# EAGLE design TCsolo_v1 (EAGLE 9.6.2)
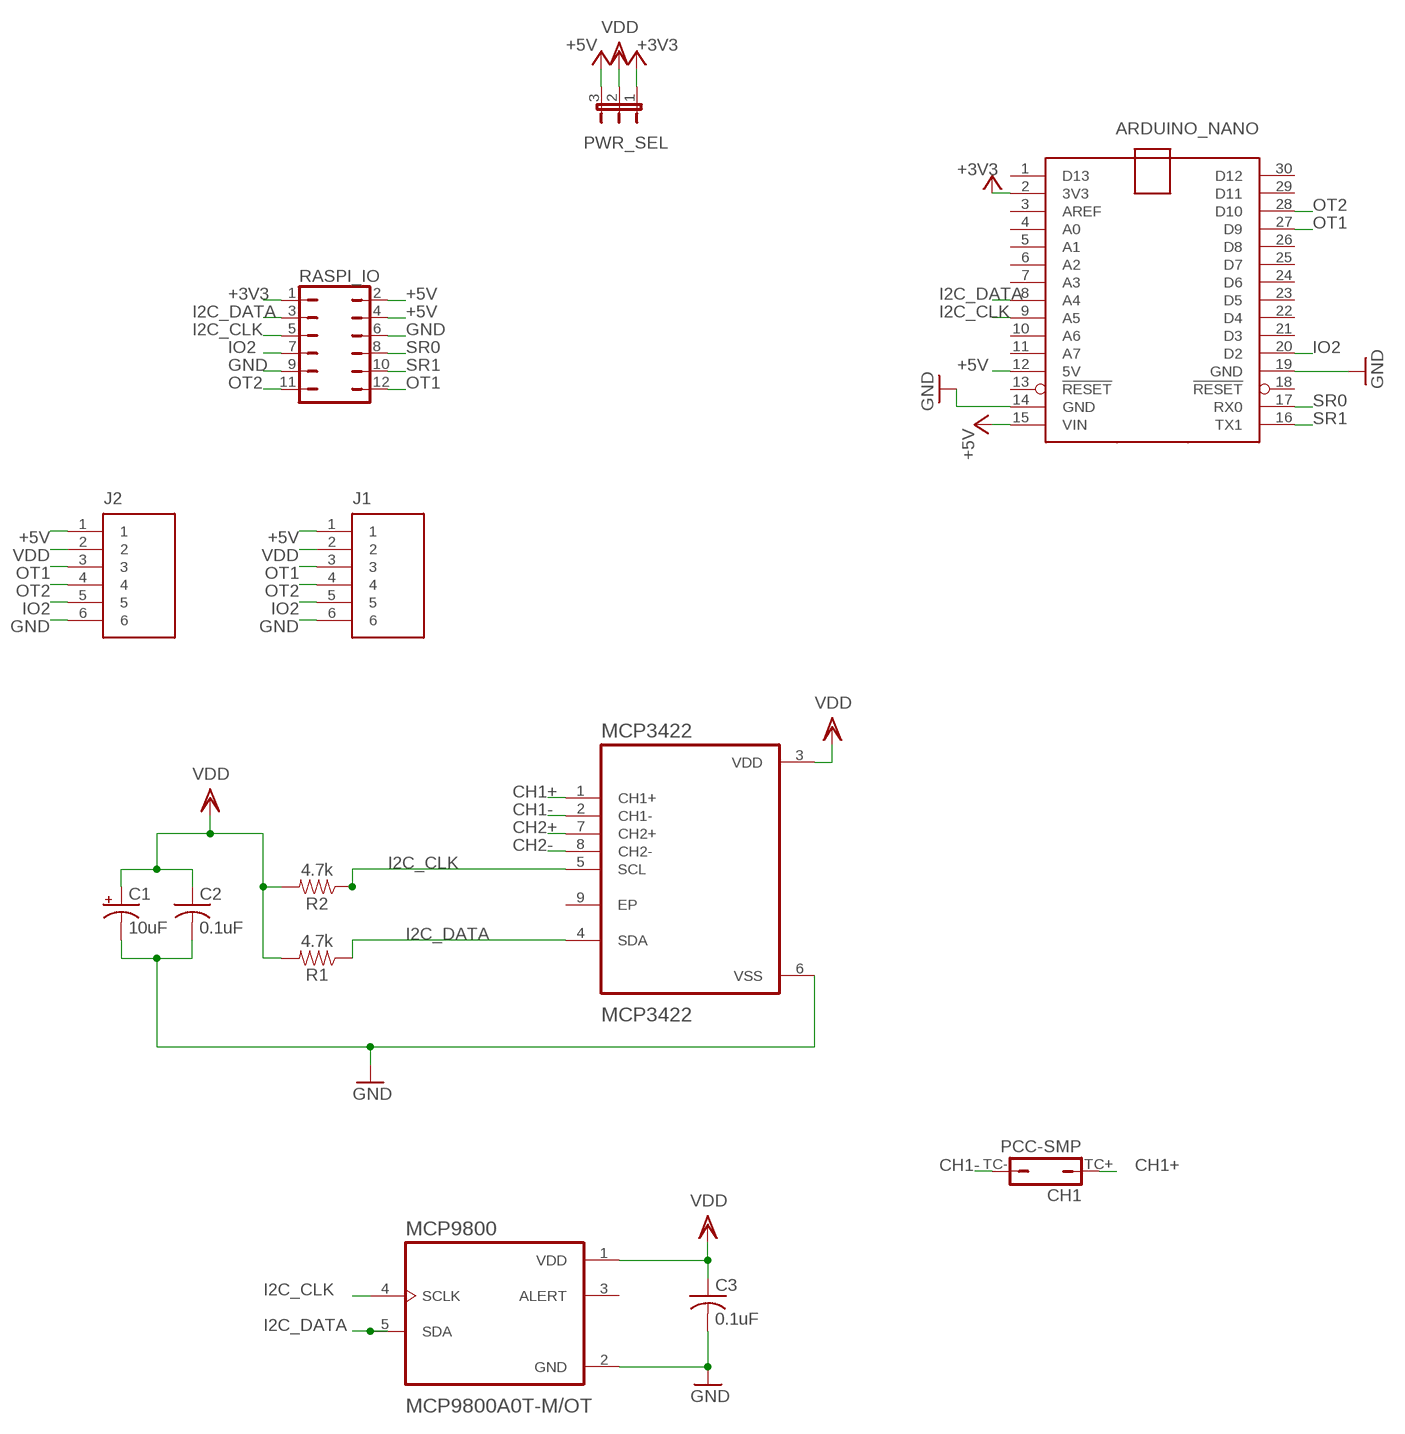
[diagram p0: schematic, sheet 1]

## Parts
ARDUINO_NANO  ARDUINO_NANO  [ARDUINO_NANO]
C1  10uF  10UF-POLAR-EIA3216-16V-10%(TANT)  [EIA3216]
C2  0.1uF  C-USC0805  [C0805]
C3  0.1uF  C-USC0805  [C0805]
CH1  PCC-SMP  [PCC-SMP]
J1  JST_6_PIN_VERTICAL  [JST-6-SMD-VERT-1.0MM]
J2  JST_6_PIN_VERTICAL  [JST-6-SMD-VERT-1.0MM]
MCP3422  MCP3422  MCP3422A0-E/MC  [SON50P200X300X100-9N]
MCP9800  MCP9800A0T-M/OT  [SOT95P270X145-5N]
PWR_SEL  JP2E  [JP2]
R1  4.7k  4.7KOHM-0603-1/10W-1%  [0603]
R2  4.7k  4.7KOHM-0603-1/10W-1%  [0603]
RASPI_IO  JP6Q  [JP6Q]

## Nets
+3V3: ARDUINO_NANO.2(3V3) PWR_SEL.1 RASPI_IO.1
+5V: ARDUINO_NANO.12(5V) ARDUINO_NANO.15(VIN) J1.1 J2.1 PWR_SEL.3 RASPI_IO.2 RASPI_IO.4
CH1+: CH1.TC+ MCP3422.1(CH1+)
CH1-: CH1.TC- MCP3422.2(CH1-)
CH2+: MCP3422.7(CH2+)
CH2-: MCP3422.8(CH2-)
GND: ARDUINO_NANO.14(GND) ARDUINO_NANO.19(GND) C1.- C2.2 C3.2 J1.6 J2.6 MCP3422.6(VSS) MCP9800.2(GND) RASPI_IO.6 RASPI_IO.9
I2C_CLK: ARDUINO_NANO.9(A5) MCP3422.5(SCL) MCP9800.4(SCLK) R2.1 RASPI_IO.5
I2C_DATA: ARDUINO_NANO.8(A4) MCP3422.4(SDA) MCP9800.5(SDA) R1.1 RASPI_IO.3
IO2: ARDUINO_NANO.20(D2) J1.5 J2.5 RASPI_IO.7
OT1: ARDUINO_NANO.27(D9) J1.3 J2.3 RASPI_IO.12
OT2: ARDUINO_NANO.28(D10) J1.4 J2.4 RASPI_IO.11
SR0: ARDUINO_NANO.17(RX0) RASPI_IO.8
SR1: ARDUINO_NANO.16(TX1) RASPI_IO.10
VDD: C1.+ C2.1 C3.1 J1.2 J2.2 MCP3422.3(VDD) MCP9800.1(VDD) PWR_SEL.2 R1.2 R2.2
Unconnected: ARDUINO_NANO.1(D13) ARDUINO_NANO.3(AREF) ARDUINO_NANO.4(A0) ARDUINO_NANO.5(A1) ARDUINO_NANO.6(A2) ARDUINO_NANO.7(A3) ARDUINO_NANO.10(A6) ARDUINO_NANO.11(A7) ARDUINO_NANO.13(!RESET) ARDUINO_NANO.18(!RESET) ARDUINO_NANO.21(D3) ARDUINO_NANO.22(D4) ARDUINO_NANO.23(D5) ARDUINO_NANO.24(D6) ARDUINO_NANO.25(D7) ARDUINO_NANO.26(D8) ARDUINO_NANO.29(D11) ARDUINO_NANO.30(D12) MCP3422.9(EP) MCP9800.3(ALERT)

## Library data of the parts
ARDUINO_NANO = ArduinoNanoV30:ARDUINO_NANO: Arduino Nano V3.0 Overview: The Arduino Nano is a small, complete, and breadboard-friendly board based on the ATmega328 (Arduino Nano 3.x) or ATmega168 (Arduino Nano 2.x). It has more or less the same functionality of the Arduino Duemilanove, but in a different package. It lacks only a DC power jack, and works with a Mini-B USB cable instead of a standard one. The Nano was designed and is being produced by Gravitech. Specifications: Microcontroller Atmel ATmega168 or ATmega328 Operating Voltage (logic level) 5 V Input Voltage (recommended) 7-12 V Input Voltage (limits) 6-20 V Digital I/O Pins 14 (of which 6 provide PWM output) Analog Input Pins 8 DC Current per I/O Pin 40 mA Flash Memory 16 KB (ATmega168) or 32 KB (ATmega328) of which 2 KB used by bootloader SRAM 1 KB (ATmega168) or 2 KB (ATmega328) EEPROM 512 bytes (ATmega168) or 1 KB (ATmega328) Clock Speed 16 MHz Dimensions 0.73" x 1.70" Length 45 mm Width 18 mm Weigth 5 g Power: The Arduino Nano can be powered via the Mini-B USB connection, 6-20V unregulated external power supply (pin 30), or 5V regulated external power supply (pin 27). The power source is automatically selected to the highest voltage source. Memory: The ATmega168 has 16 KB of flash memory for storing code (of which 2 KB is used for the bootloader); the ATmega328 has 32 KB, (also with 2 KB used for the bootloader). The ATmega168 has 1 KB of SRAM and 512 bytes of EEPROM (which can be read and written with the EEPROM library); the ATmega328 has 2 KB of SRAM and 1 KB of EEPROM. Input and Output: Each of the 14 digital pins on the Nano can be used as an input or output, using pinMode(), digitalWrite(), and digitalRead() functions. They operate at 5 volts. Each pin can provide or receive a maximum of 40 mA and has an internal pull-up resistor (disconnected by default) of 20-50 kOhms. In addition, some pins have specialized functions. Visit Arduino - ArduinoBoardNano <https://www.arduino.cc/en/Main/ArduinoBoardNano>
C1 = SparkFun-Capacitors:10UF-POLAR: 10.0µF polarized capacitors A capacitor is a passive two-terminal electrical component used to store electrical energy temporarily in an electric field.; PROD_ID: CAP-00811
C2 C3 = adafruit:C-US: CAPACITOR, American symbol
CH1 = PCC-SMP:PCC-SMP
J1 J2 = SparkFun-Connectors:JST_6_PIN_VERTICAL: JST 6 pin vertical connector Here is a six pin vertical 1.0mm pitch connector. It is useful if you need something very tiny as a connection. These are not the standard JST type connectors we use on most of our boards, but are actually the much smaller JST-SH type. Here is the connector we sell at SparkFun: JST SH Vertical 6-Pin Connector - SMD <https://www.sparkfun.com/products/579> (GPS-00579) Datasheet <http://www.sparkfun.com/datasheets/GPS/EM406-SMDConnector-eSH.pdf> It was used on these SparkFun products: SparkFun GPS Breakout <https://www.sparkfun.com/products/11818> (BOB-11818) SparkFun Weather Shield <https://www.sparkfun.com/products/12081> (DEV-12081) And many, many other GPS related products.; PROD_ID: CONN-08249; SF_ID: GPS-00579
MCP3422 = MCP3422A0-E_MC:MCP3422A0-E/MC; DESCRIPTION: 18 Bit Analog to Digital Converter 2 Input 1 Sigma-Delta 8-DFN (2x3); DIGI-KEY_PART_NUMBER: MCP3422A0-E/MC-ND; MF: Microchip; MP: MCP3422A0-E/MC; PACKAGE: DFN-8 Microchip; PURCHASE-URL: https://pricing.snapeda.com/search/part/MCP3422A0-E/MC/?ref=eda
MCP9800 = MCP9800A0T-M_OT:MCP9800A0T-M/OT; DESCRIPTION: Temperature Sensor Digital, Local -55°C ~ 125°C 11 b SOT-23-5; DIGI-KEY_PART_NUMBER: MCP9800A0T-M/OTCT-ND; MF: Microchip; MP: MCP9800A0T-M/OT; PACKAGE: SOT-23-5 Microchip; PURCHASE-URL: https://pricing.snapeda.com/search/part/MCP9800A0T-M/OT/?ref=eda
PWR_SEL = jumper-piTC:JP2E: JUMPER
R1 R2 = SparkFun-Resistors:4.7KOHM: 4.7kΩ resistor A resistor is a passive two-terminal electrical component that implements electrical resistance as a circuit element. Resistors act to reduce current flow, and, at the same time, act to lower voltage levels within circuits. - Wikipedia; PROD_ID: RES-07857
RASPI_IO = jumper-3:JP6Q: JUMPER

## Net classes
0 default: width 0.305 mm, drill 0.127 mm, clearance 0.203 mm
1 DC: width 0.61 mm, drill 0.254 mm, clearance 0.406 mm
2 AC: width 5.08 mm, drill 0.305 mm, clearance 5.08 mm
3 Hole: drill 2.05 mm, clearance 4.8 mm

## Board
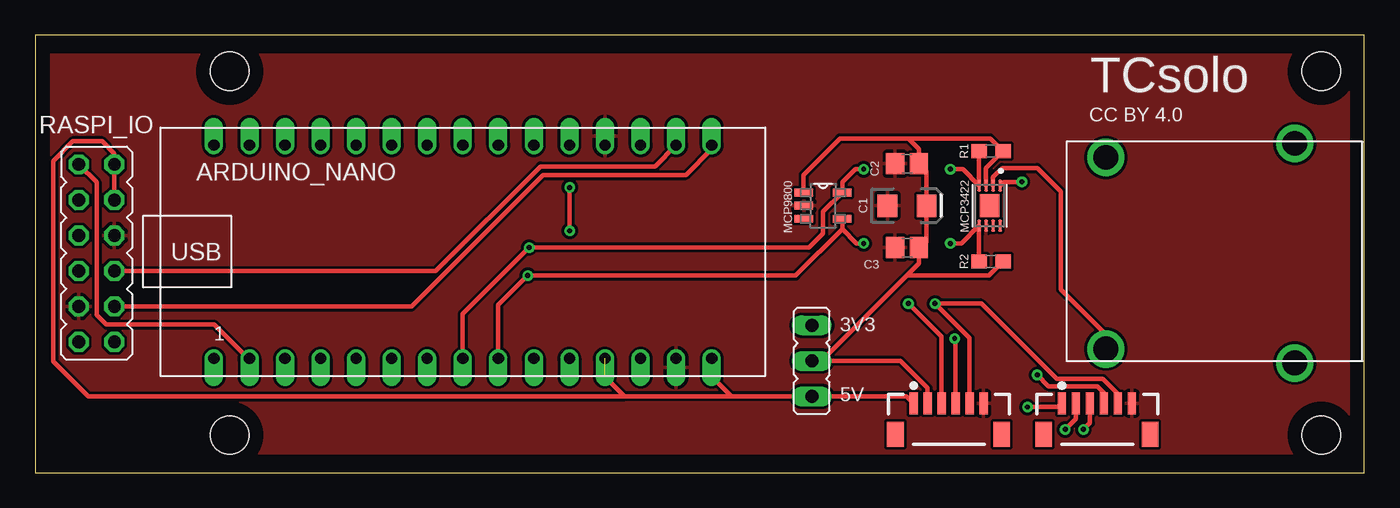
[diagram p1: board, top side]
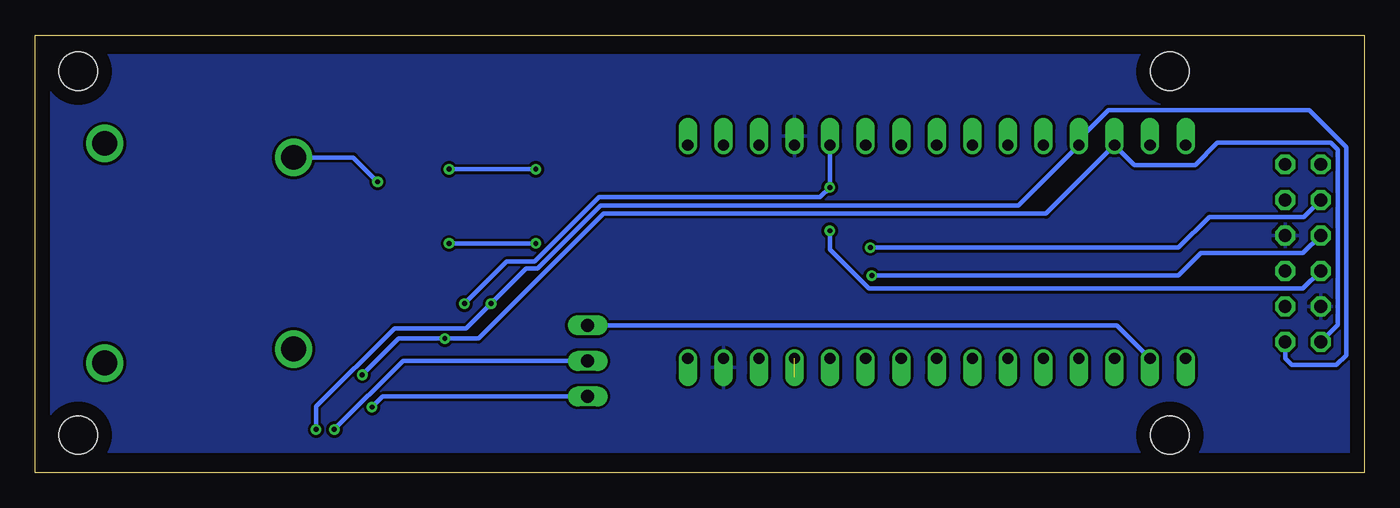
[diagram p2: board, bottom side, seen from below]

Size 94.98 x 31.3 mm. Coordinates in mm from the lower left corner, seen from the top.
Outline: 0,31.3 0,0 94.98,0 94.98,31.3 0,31.3
Copper layers (1*16): Top 0.035mm / dielectric 1.5mm / Bottom 0.035mm
Design rules "default": minimum track width 6mil, minimum drill 0.35mm, track to track 6mil, track to pad 6mil, pad to pad 6mil, via to via 6mil, smd to smd 6mil, copper to edge 40mil, drill to drill 6mil, minimum pad ring 10mil, minimum via ring 8mil, stop-mask expansion 4mil, vias tented up to drill 0mil, thermal gap 10mil
Holes 2.75 mm at 91.9,28.7 91.9,2.7 13.9,2.7 13.9,28.7

### Footprints (pad centres in the part's own frame; a part is rotated, then mirrored left to right if it is on the bottom)
ARDUINO_NANO = drill 0.8 offset: 1 -20.32,-7.62; 2 -17.78,-7.62; 3 -15.24,-7.62; 4 -12.7,-7.62; 5 -10.16,-7.62; 6 -7.62,-7.62; 7 -5.08,-7.62; 8 -2.54,-7.62; 9 0,-7.62; 10 2.54,-7.62; 11 5.08,-7.62; 12 7.62,-7.62; 13 10.16,-7.62; 14 12.7,-7.62; 15 15.24,-7.62; 16 15.24,7.62; 17 12.7,7.62; 18 10.16,7.62; 19 7.62,7.62; 20 5.08,7.62; 21 2.54,7.62; 22 0,7.62; 23 -2.54,7.62; 24 -5.08,7.62; 25 -7.62,7.62; 26 -10.16,7.62; 27 -12.7,7.62; 28 -15.24,7.62; 29 -17.78,7.62; 30 -20.32,7.62
EIA3216 = smd 1.4 x 1.6: + 1.4,0; - -1.4,0
C0805 = smd 1.3 x 1.5: 1 -0.85,0; 2 0.85,0
PCC-SMP = drill 1.778: CLIP0 7.85,13.5; CLIP1 -7.85,13.5; TC+ -6.85,0; TC- 6.85,0
JST-6-SMD-VERT-1.0MM = smd 0.6 x 1.55: 1 -2.54,1.27; 2 -1.54,1.27; 3 -0.54,1.27; 4 0.46,1.27; 5 1.46,1.27; 6 2.46,1.27 | smd 1.2 x 1.8: P$1 -3.84,-0.955; P$2 3.76,-0.955
SON50P200X300X100-9N = smd 0.84 x 0.27: 1 -1.435,0.75; 2 -1.435,0.25; 3 -1.435,-0.25; 4 -1.435,-0.75; 5 1.435,-0.75; 6 1.435,-0.25; 7 1.435,0.25; 8 1.435,0.75 | smd 1.625 x 1.425: 9 0,0
SOT95P270X145-5N = smd 1.321 x 0.559: 1 -1.372,0.94; 2 -1.372,0; 3 -1.372,-0.94; 4 1.372,-0.94; 5 1.372,0.94
JP2 = drill 0.914 long: 1 -2.54,0; 2 0,0; 3 2.54,0
0603 = smd 1.1 x 1: 1 -0.85,0; 2 0.85,0
JP6Q = drill 0.914 octagon: 1 -6.35,-1.27; 2 -6.35,1.27; 3 -3.81,-1.27; 4 -3.81,1.27; 5 -1.27,-1.27; 6 -1.27,1.27; 7 1.27,-1.27; 8 1.27,1.27; 9 3.81,-1.27; 10 3.81,1.27; 11 6.35,-1.27; 12 6.35,1.27

### Placement (x,y rotation side)
ARDUINO_NANO  33.1,15.8 0 top
C1  62.3,19.1 0 top
C2  62.3,22.1 180 top
C3  62.3,16.1 180 top
CH1  76.5,15.7 270 top
J1  65.3,3.7 0 top
J2  75.9,3.7 0 top
MCP3422  68.2,19.1 270 top
MCP9800  56.3,19.1 0 top
PWR_SEL  55.5,8 270 top
R1  68.3,23 0 top
R2  68.3,15.1 0 top
RASPI_IO  4.4,15.7 270 top

### Tracks (layer width: path | path; a pad name or v marks a point on that pad's centre or on a via)
+3V3
  Top 0.305: ARDUINO_NANO.2 15.22,8.18 12.8,10.6 5.1,10.6 4.4,11.3 4.4,20.78 RASPI_IO.1
  Bottom 0.305: PWR_SEL.1 17.68,10.54 ARDUINO_NANO.2
+5V  (via drill 0.35)  (1 unrouted)
  Top 0.305: 42.1,5.47 3.8,5.47 1.3,7.97 1.3,22.3 2.7,23.7 4.8,23.7 5.67,22.83 RASPI_IO.2 RASPI_IO.4 | 40.72,6.85 42.1,5.47 | 49.75,5.47 PWR_SEL.3 62.26,5.47 J1.1 | 49.75,5.47 42.1,5.47 | v70.9,4.7 73.09,4.7 J2.1 | 49.75,5.47 48.34,6.88 ARDUINO_NANO.15
  Bottom 0.305: PWR_SEL.3 70.14,5.46 v70.9,4.7
CH1+  (via drill 0.35)
  Top 0.305: MCP3422.1 69.22,20.8 v70.5,20.8
  Bottom 0.305: v70.5,20.8 72.25,22.55 CH1.TC+
CH1-
  Top 0.305: MCP3422.2 68.45,21.15 69.1,21.8 71.6,21.8 73.3,20.1 73.3,13.1 76.5,9.9 CH1.TC-
GND
  pour Top: 0.8,29.9 0.8,1.4 94.2,1.4 94.2,29.9
  pour Bottom: 0.8,29.9 0.8,1.47 94.2,1.47 94.2,29.9
I2C_CLK  (via drill 0.35)
  Top 0.305: v59.2,16.4 58.7,16.4 57.67,17.43 | 57.67,17.43 MCP9800.4 | ARDUINO_NANO.9 33.1,11.99 v35.2,14.09 v35.2,14.1 54.34,14.1 57.67,17.43 | R2.1 MCP3422.5 66.19,16.4 v65.4,16.4
  Bottom 0.305: v65.4,16.4 v59.2,16.4 | RASPI_IO.5 4.4,15.7 11.7,15.7 13.3,14.1 v35.2,14.1
I2C_DATA  (via drill 0.35)
  Top 0.305: v59.2,21.7 58.6,21.7 57.67,20.77 MCP9800.5 56.3,18.67 56.3,17.1 55.3,16.1 v35.3,16.1 30.56,11.36 ARDUINO_NANO.8 | R1.1 MCP3422.4 66.28,21.7 v65.4,21.7
  Bottom 0.305: v65.4,21.7 v59.2,21.7 | v35.3,16.1 13.3,16.1 11.1,18.3 4.34,18.3 RASPI_IO.3
IO2  (via drill 0.35)
  Top 0.305: v38.2,20.4 v38.2,17.3 | J1.5 66.76,9.64 v64.3,12.1 67.6,12.1 73,6.7 76.3,6.7 77.36,5.64 J2.5
  Bottom 0.305: v64.3,12.1 61.3,15.1 59.3,15.1 54.7,19.7 38.9,19.7 v38.2,20.4 38.18,20.42 ARDUINO_NANO.20 | v38.2,17.3 38.2,15.96 35.4,13.16 4.4,13.16 RASPI_IO.7
OT1  (via drill 0.35)
  Top 0.305: v62.4,12.1 64.76,9.74 J1.3 | v74.9,3.1 75.36,3.56 J2.3
  Bottom 0.305: RASPI_IO.12 5.67,8.17 5.2,7.7 2,7.7 1.3,8.4 1.3,23.3 3.93,25.93 18.3,25.93 20.4,23.83 ARDUINO_NANO.27 24.72,19.1 54.58,19.1 59.09,14.59 59.91,14.59 v62.4,12.1 64.17,10.33 69.3,10.33 74.9,4.74 v74.9,3.1
OT2  (via drill 0.35)
  Top 0.305: v65.7,9.6 65.76,9.6 J1.4 | v71.6,7 72.41,6.19 75.9,6.19 76.36,5.73 J2.4
  Bottom 0.305: RASPI_IO.11 1.9,10.58 1.9,23.1 2.4,23.6 10.5,23.6 12.1,22 16.44,22 ARDUINO_NANO.28 22.75,18.53 54.37,18.53 63.3,9.6 v65.7,9.6 69,9.6 v71.6,7
SR0
  Top 0.305: RASPI_IO.8 28.63,14.43 36.1,21.9 44.28,21.9 ARDUINO_NANO.17
SR1
  Top 0.305: RASPI_IO.10 26.89,11.89 36.3,21.3 46.5,21.3 48.34,23.14 ARDUINO_NANO.16
VDD  (via drill 0.35)
  Top 0.305: MCP3422.3 67.95,21.8 R1.2 68.25,23.9 62.4,23.9 | 62.4,23.9 57.5,23.9 54.9,21.3 54.9,20.07 MCP9800.1 | 62.3,14.1 63.15,14.95 C3.1 63.23,16.02 63.7,16.5 C1.+ 63.7,21.55 C2.1 63.15,23.15 62.4,23.9 | R2.2 68.15,14.1 62.3,14.1 | 56.2,8 62.3,14.1 | PWR_SEL.2 56.2,8 | J1.2 63.76,6.07 61.83,8 56.2,8 | v73.6,3.1 74.36,3.86 J2.2
  Bottom 0.305: PWR_SEL.2 68.7,8 v73.6,3.1

### Text on the board
tNames: TCsolo | CC BY 4.0
_tNames: 3V3 | 5V